# EAGLE design cryobondr-qbit2-pqc-rev2 (EAGLE 6.1)
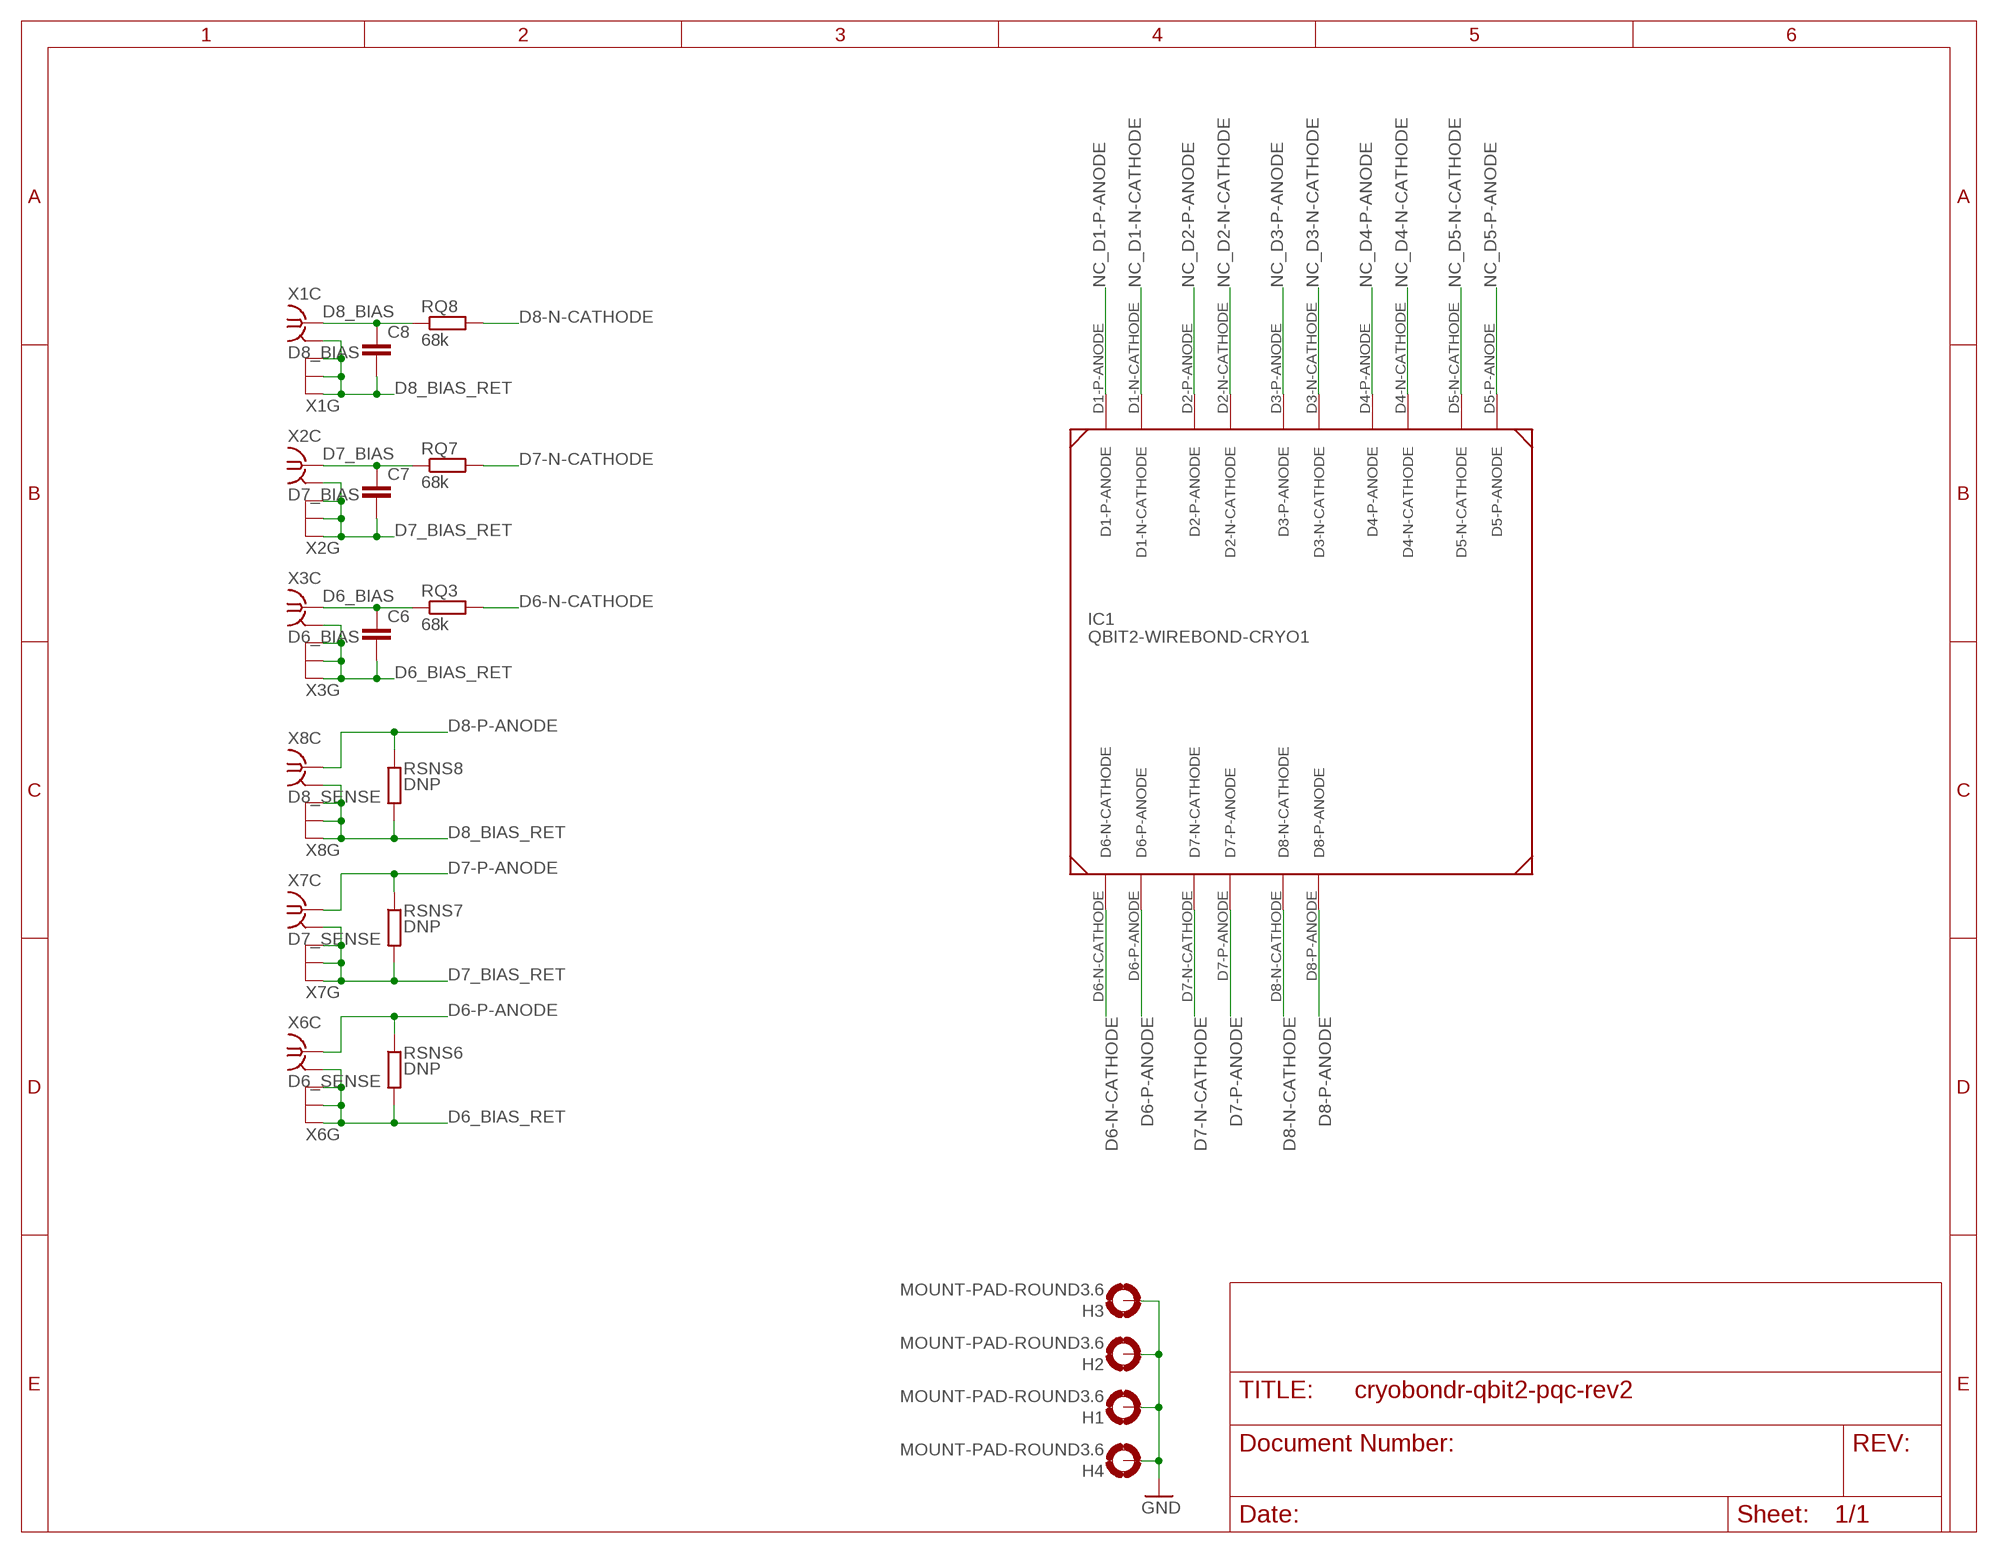
[diagram p0: schematic, sheet 1]

## Parts
C6  C-EUC0603  [C0603]
C7  C-EUC0603  [C0603]
C8  C-EUC0603  [C0603]
H1  MOUNT-PAD-ROUND3.6  [3,6-PAD]
H2  MOUNT-PAD-ROUND3.6  [3,6-PAD]
H3  MOUNT-PAD-ROUND3.6  [3,6-PAD]
H4  MOUNT-PAD-ROUND3.6  [3,6-PAD]
IC1  QBIT2-WIREBOND-CRYO1  [QBIT2-WIREBOND-CRYO1]
RQ3  68k  R-EU_R0603  [R0603]
RQ7  68k  R-EU_R0603  [R0603]
RQ8  68k  R-EU_R0603  [R0603]
RSNS6  DNP  R-EU_R0603  [R0603]
RSNS7  DNP  R-EU_R0603  [R0603]
RSNS8  DNP  R-EU_R0603  [R0603]
X1  D8_BIAS  MMCXBIGPAD  [MMCX-SMT-BIGPADS]
X2  D7_BIAS  MMCXBIGPAD  [MMCX-SMT-BIGPADS]
X3  D6_BIAS  MMCXBIGPAD  [MMCX-SMT-BIGPADS]
X6  D6_SENSE  MMCXBIGPAD  [MMCX-SMT-BIGPADS]
X7  D7_SENSE  MMCXBIGPAD  [MMCX-SMT-BIGPADS]
X8  D8_SENSE  MMCXBIGPAD  [MMCX-SMT-BIGPADS]

## Nets
D6-N-CATHODE: IC1.D6-N-CATHODE RQ3.2
D6-P-ANODE: IC1.D6-P-ANODE RSNS6.1 X6.S
D6_BIAS: C6.1 RQ3.1 X3.S
D6_BIAS_RET: C6.2 RSNS6.2 X3.G1(C:GND) X3.G2(G:GND) X3.G3(G:GND) X3.G4(G:GND) X6.G1(C:GND) X6.G2(G:GND) X6.G3(G:GND) X6.G4(G:GND)
D7-N-CATHODE: IC1.D7-N-CATHODE RQ7.2
D7-P-ANODE: IC1.D7-P-ANODE RSNS7.1 X7.S
D7_BIAS: C7.1 RQ7.1 X2.S
D7_BIAS_RET: C7.2 RSNS7.2 X2.G1(C:GND) X2.G2(G:GND) X2.G3(G:GND) X2.G4(G:GND) X7.G1(C:GND) X7.G2(G:GND) X7.G3(G:GND) X7.G4(G:GND)
D8-N-CATHODE: IC1.D8-N-CATHODE RQ8.2
D8-P-ANODE: IC1.D8-P-ANODE RSNS8.1 X8.S
D8_BIAS: C8.1 RQ8.1 X1.S
D8_BIAS_RET: C8.2 RSNS8.2 X1.G1(C:GND) X1.G2(G:GND) X1.G3(G:GND) X1.G4(G:GND) X8.G1(C:GND) X8.G2(G:GND) X8.G3(G:GND) X8.G4(G:GND)
GND: H1.B3,6(MOUNT) H2.B3,6(MOUNT) H3.B3,6(MOUNT) H4.B3,6(MOUNT)
NC_D1-N-CATHODE: IC1.D1-N-CATHODE
NC_D1-P-ANODE: IC1.D1-P-ANODE
NC_D2-N-CATHODE: IC1.D2-N-CATHODE
NC_D2-P-ANODE: IC1.D2-P-ANODE
NC_D3-N-CATHODE: IC1.D3-N-CATHODE
NC_D3-P-ANODE: IC1.D3-P-ANODE
NC_D4-N-CATHODE: IC1.D4-N-CATHODE
NC_D4-P-ANODE: IC1.D4-P-ANODE
NC_D5-N-CATHODE: IC1.D5-N-CATHODE
NC_D5-P-ANODE: IC1.D5-P-ANODE

## Library data of the parts
C6-C8 = rcl:C-EU: CAPACITOR, European symbol
H1-H4 = holes:MOUNT-PAD-ROUND: MOUNTING PAD, round
IC1 = meng:QBIT2-WIREBOND-CRYO1
RQ3 RQ7 RQ8 RSNS6-RSNS8 = resistor:R-EU_: RESISTOR, European symbol
X1-X3 X6-X8 = meng:MMCX

## Board
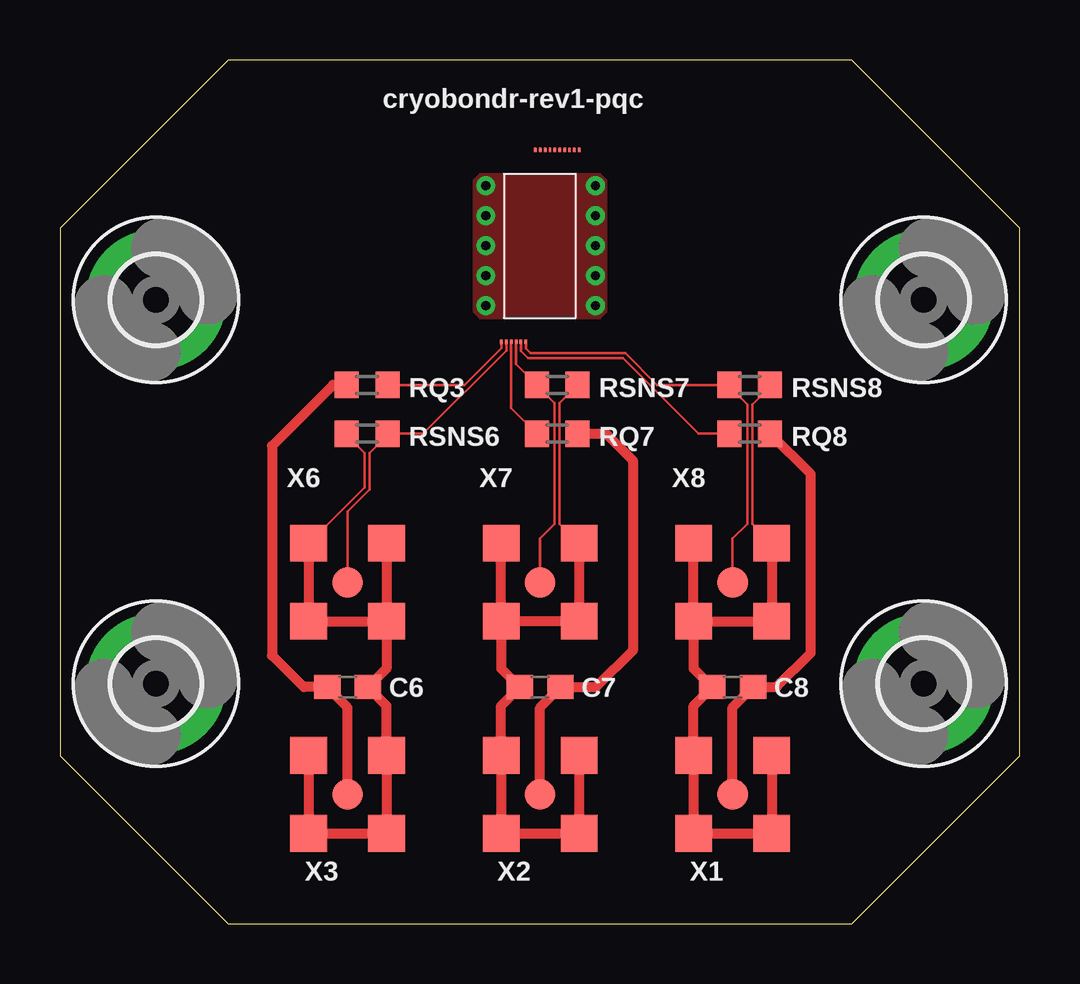
[diagram p1: board, top side]
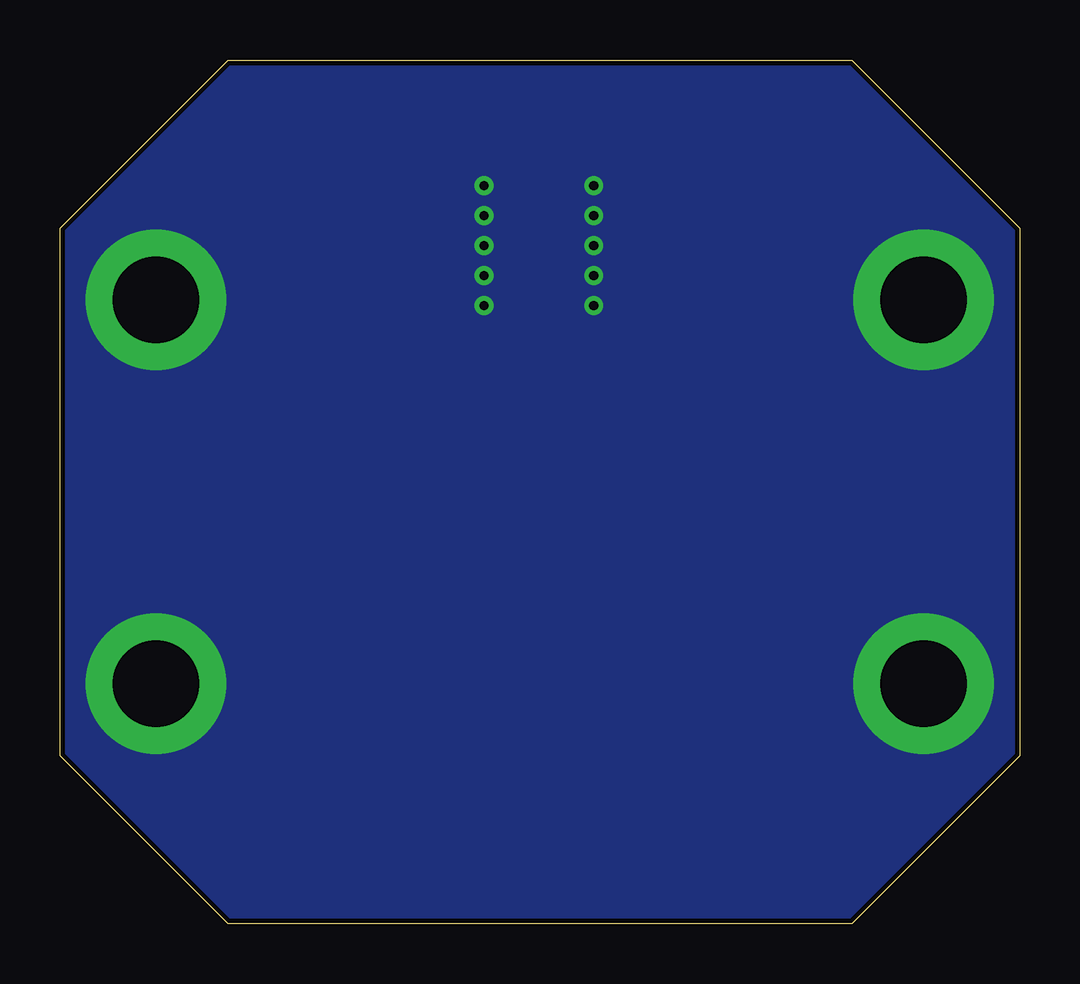
[diagram p2: board, bottom side, seen from below]

Size 40 x 36 mm. Coordinates in mm from the lower left corner, seen from the top.
Outline: 7,0 33,0 40,7 40,29 33,36 7,36 0,29 0,7 7,0
Copper layers (1*16): Top 0.035mm / dielectric 1.5mm / Bottom 0.035mm
Design rules: minimum track width 4mil, minimum drill 15mil, track to track 4mil, track to pad 4mil, pad to pad 4mil, via to via 4mil, smd to smd 4mil, copper to edge 8mil, drill to drill 8mil, minimum pad ring 10mil, minimum via ring 8mil, stop-mask expansion 4mil, vias tented up to drill 0mil, thermal gap 10mil

### Footprints (pad centres in the part's own frame; a part is rotated, then mirrored left to right if it is on the bottom)
C0603 = smd 1.1 x 1: 1 -0.85,0; 2 0.85,0
3,6-PAD = drill 3.6 pad 5.842: B3,6 0,0
QBIT2-WIREBOND-CRYO1 = smd 0.102 x 0.203: D1-N-CATHODE 0.02,4; D1-P-ANODE -0.183,4; D2-N-CATHODE 0.223,4; D2-P-ANODE 0.426,4; D3-N-CATHODE 0.63,4; D3-P-ANODE 1.239,4; D4-N-CATHODE 0.833,4; D4-P-ANODE 1.036,4; D5-N-CATHODE 1.442,4; D5-P-ANODE 1.646,4; D6-N-CATHODE -1.598,-4; D6-P-ANODE -1.394,-4; D7-N-CATHODE -1.191,-4; D7-P-ANODE -0.988,-4; D8-N-CATHODE -0.785,-4; D8-P-ANODE -0.582,-4
R0603 = smd 1 x 1.1: 1 -0.85,0; 2 0.85,0
MMCX-SMT-BIGPADS = smd 1.524 x 1.524: G1 -1.626,1.626; G2 1.626,1.626; G3 1.626,-1.626; G4 -1.626,-1.626 | smd 1.27 x 1.27: S 0,0

### Placement (x,y rotation side)
C6  11.99,9.86 0 top
C7  20.02,9.86 180 top
C8  28.04,9.86 180 top
H1  36,10 0 top
H2  4,10 0 top
H3  36,26 0 top
H4  4,26 0 top
IC1  20,28.25 0 top
RQ3  12.8,22.45 0 top
RQ7  20.73,20.42 180 top
RQ8  28.75,20.42 180 top
RSNS6  12.8,20.42 180 top
RSNS7  20.73,22.45 0 top
RSNS8  28.75,22.45 0 top
X1  28.04,5.38 0 top
X2  20.02,5.38 0 top
X3  11.99,5.38 0 top
X6  11.99,14.22 0 top
X7  20.02,14.22 0 top
X8  28.04,14.22 0 top

### Tracks (layer width: path | path; a pad name or v marks a point on that pad's centre or on a via)
D6-N-CATHODE
  Top 0.102: IC1.D6-N-CATHODE 18.4,23.99 16.87,22.45 RQ3.2
D6-P-ANODE
  Top 0.102: IC1.D6-P-ANODE 18.61,23.89 15.14,20.42 RSNS6.1 13.65,20.36 12.9,19.61 12.9,18.09 11.99,17.17 X6.S
D6_BIAS
  Top 0.406: X3.S 11.99,9.01 C6.1 10.16,9.86 8.84,11.18 8.84,19.91 11.38,22.45 RQ3.1
D6_BIAS_RET
  Top 0.102: RSNS6.2 11.95,20.36 12.7,19.61 12.7,18.19 X6.G1
  Top 0.406: X6.G3 13.61,10.63 C6.2 13.61,9.08 X3.G2 X3.G3 X3.G4 X3.G1 | X6.G1 X6.G4 X6.G3 | X6.G2 X6.G3
D7-N-CATHODE
  Top 0.102: IC1.D7-N-CATHODE 18.81,21.49 RQ7.2
D7-P-ANODE
  Top 0.102: IC1.D7-P-ANODE 19.01,23.32 RSNS7.1 | RSNS7.1 19.88,22.39 | X7.S 20.02,16.05 20.62,16.66 20.62,21.7 RSNS7.1
D7_BIAS
  Top 0.406: X2.S 20.02,9.01 C7.1 22.35,9.86 23.88,11.38 23.88,19.3 22.76,20.42 RQ7.1
D7_BIAS_RET
  Top 0.102: X7.G2 20.83,16.66 20.83,21.7 RSNS7.2
  Top 0.406: X7.G4 18.39,10.63 C7.2 18.39,9.08 X2.G1 X2.G4 X2.G3 X2.G2 | X7.G4 X7.G1 | X7.G4 X7.G3 X7.G2
D8-N-CATHODE
  Top 0.102: IC1.D8-N-CATHODE 19.21,23.86 19.51,23.57 23.47,23.57 26.62,20.42 RQ8.2
D8-P-ANODE
  Top 0.102: X8.S 28.04,16.05 28.65,16.66 28.65,21.64 27.9,22.39 RSNS8.1 24.89,22.45 23.57,23.77 19.61,23.77 19.42,23.96 IC1.D8-P-ANODE
D8_BIAS
  Top 0.406: X1.S 28.04,9.01 C8.1 29.87,9.86 31.29,11.28 31.29,18.73 RQ8.1
D8_BIAS_RET
  Top 0.102: RSNS8.2 29.6,22.39 28.85,21.64 28.85,16.66 X8.G2
  Top 0.406: X8.G4 26.42,10.63 C8.2 26.42,9.08 X1.G1 X1.G4 X1.G3 X1.G2 | X8.G4 X8.G1 | X8.G4 X8.G3 X8.G2
GND  (via drill 0.38)
  other vias: 17.75,30.76 17.75,29.51 17.75,28.26 17.75,27.01 17.75,25.76 22.32,30.76 22.32,29.51 22.32,28.26 22.32,27.01 22.32,25.76
  pour Bottom (no thermals): 0,0 40,0 40,36 0,36
  pour Top: 17.25,25.5 17.5,25.25 22.5,25.25 22.75,25.5 22.75,31 22.5,31.25 17.5,31.25 17.25,31

### Text on the board
tPlace: cryobondr-rev1-pqc